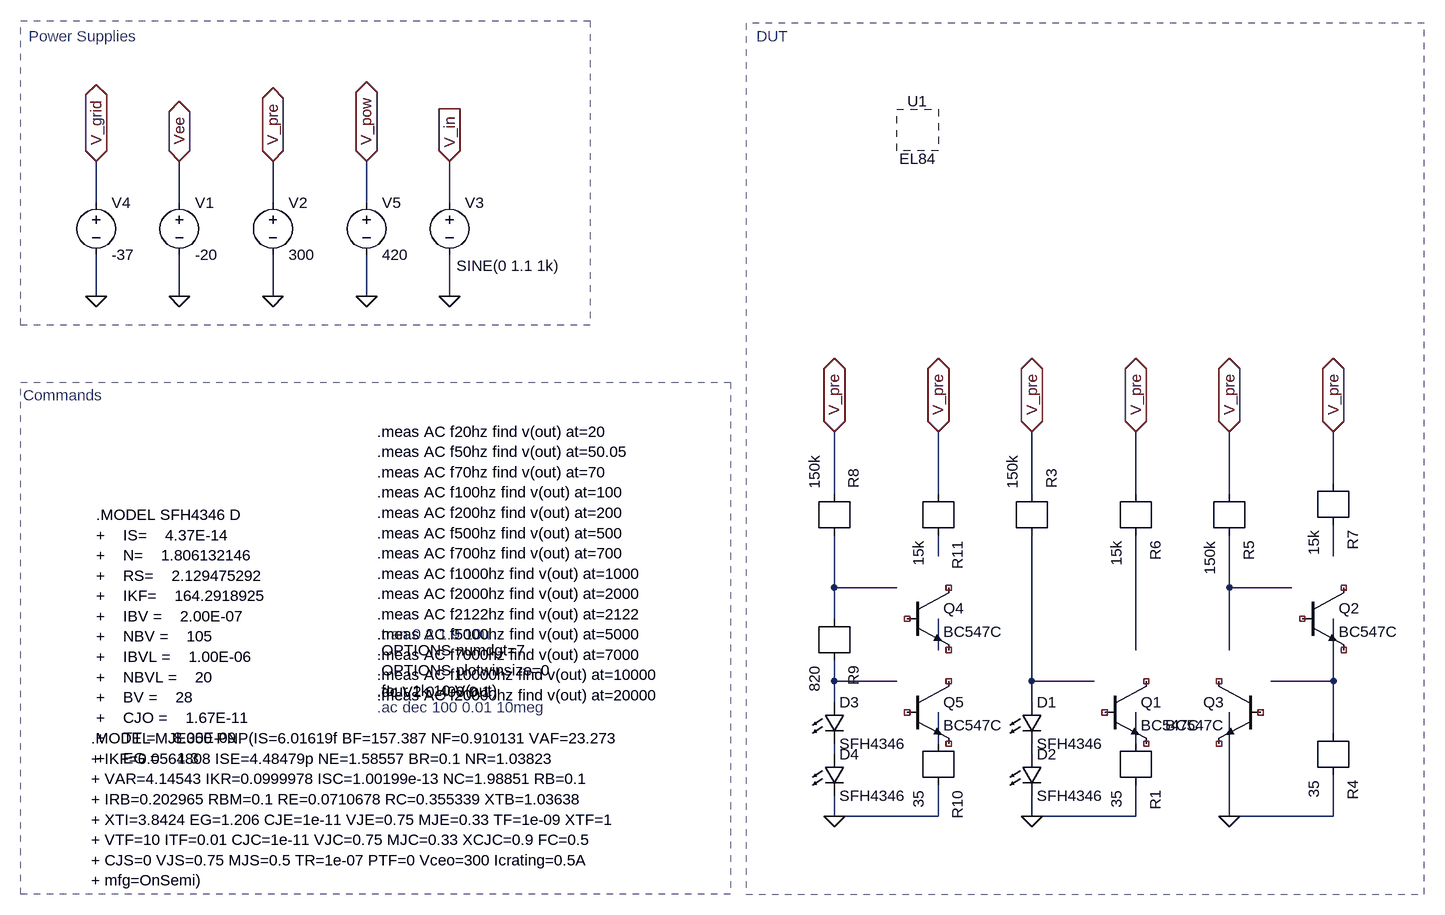
[diagram p0: schematic POWER_AMP_IC_current_sink.asc]
POWER_AMP_IC_current_sink.asc, the LTspice schematic file:
Version 4
SHEET 1 2044 1972
WIRE -2512 688 -2512 624
WIRE -2384 688 -2384 624
WIRE -2240 688 -2240 624
WIRE -2096 688 -2096 624
WIRE -1968 688 -1968 624
WIRE -2512 832 -2512 768
WIRE -2384 832 -2384 768
WIRE -2240 832 -2240 768
WIRE -2096 832 -2096 768
WIRE -1968 832 -1968 768
WIRE -608 1120 -608 1040
WIRE -1376 1136 -1376 1040
WIRE -1216 1136 -1216 1040
WIRE -1072 1136 -1072 1040
WIRE -912 1136 -912 1040
WIRE -768 1136 -768 1040
WIRE -1216 1232 -1216 1200
WIRE -608 1232 -608 1184
WIRE -1376 1280 -1376 1200
WIRE -1280 1280 -1376 1280
WIRE -768 1280 -768 1200
WIRE -672 1280 -768 1280
WIRE -1376 1328 -1376 1280
WIRE -1216 1376 -1216 1328
WIRE -912 1376 -912 1200
WIRE -768 1376 -768 1280
WIRE -1376 1424 -1376 1392
WIRE -1280 1424 -1376 1424
WIRE -1072 1424 -1072 1200
WIRE -976 1424 -1072 1424
WIRE -608 1424 -608 1328
WIRE -608 1424 -704 1424
WIRE -1376 1456 -1376 1424
WIRE -1072 1456 -1072 1424
WIRE -608 1504 -608 1424
WIRE -1216 1520 -1216 1472
WIRE -912 1520 -912 1472
WIRE -1376 1536 -1376 1520
WIRE -1072 1536 -1072 1520
WIRE -1376 1632 -1376 1600
WIRE -1216 1632 -1216 1584
WIRE -1216 1632 -1376 1632
WIRE -1072 1632 -1072 1600
WIRE -912 1632 -912 1584
WIRE -912 1632 -1072 1632
WIRE -768 1632 -768 1472
WIRE -608 1632 -608 1568
WIRE -608 1632 -768 1632
FLAG -1968 832 0
FLAG -2096 832 0
FLAG -2240 832 0
FLAG -2384 832 0
FLAG -2512 832 0
FLAG -2512 624 V_grid
IOPIN -2512 624 BiDir
FLAG -2384 624 Vee
IOPIN -2384 624 BiDir
FLAG -2240 624 V_pre
IOPIN -2240 624 BiDir
FLAG -2096 624 V_pow
IOPIN -2096 624 BiDir
FLAG -1968 624 V_in
IOPIN -1968 624 In
FLAG -1072 1040 V_pre
IOPIN -1072 1040 BiDir
FLAG -912 1040 V_pre
IOPIN -912 1040 BiDir
FLAG -768 1040 V_pre
IOPIN -768 1040 BiDir
FLAG -608 1040 V_pre
IOPIN -608 1040 BiDir
FLAG -1072 1632 0
FLAG -768 1632 0
FLAG -1376 1040 V_pre
IOPIN -1376 1040 BiDir
FLAG -1216 1040 V_pre
IOPIN -1216 1040 BiDir
FLAG -1376 1632 0
SYMBOL npn -960 1424 R0
SYMATTR InstName Q1
SYMATTR Value BC547C
SYMBOL r -912 1520 R90
SYMATTR InstName R1
SYMATTR Value 35
SYMBOL r -1072 1200 M270
SYMATTR InstName R3
SYMATTR Value 150k
SYMBOL voltage -2384 672 R0
SYMATTR InstName V1
SYMATTR Value -20
SYMBOL voltage -2240 672 R0
SYMATTR InstName V2
SYMATTR Value 300
SYMBOL voltage -1968 672 R0
WINDOW 3 11 113 Left 2
SYMATTR Value SINE(0 1.1 1k)
SYMATTR InstName V3
SYMATTR Value2 AC 1
SYMBOL voltage -2512 672 R0
SYMATTR InstName V4
SYMATTR Value -37
SYMBOL voltage -2096 672 R0
SYMATTR InstName V5
SYMATTR Value 420
SYMBOL npn -656 1280 R0
SYMATTR InstName Q2
SYMATTR Value BC547C
SYMBOL npn -720 1424 M0
SYMATTR InstName Q3
SYMATTR Value BC547C
SYMBOL r -608 1504 R90
SYMATTR InstName R4
SYMATTR Value 35
SYMBOL r -768 1136 R90
SYMATTR InstName R5
SYMATTR Value 150k
SYMBOL r -912 1136 R90
SYMATTR InstName R6
SYMATTR Value 15k
SYMBOL r -608 1120 R90
SYMATTR InstName R7
SYMATTR Value 15k
SYMBOL LED -1088 1456 R0
SYMATTR InstName D1
SYMATTR Value SFH4346
SYMBOL LED -1088 1536 R0
SYMATTR InstName D2
SYMATTR Value SFH4346
SYMBOL r -1376 1328 R90
SYMATTR InstName R9
SYMATTR Value 820
SYMBOL r -1216 1520 R90
SYMATTR InstName R10
SYMATTR Value 35
SYMBOL npn -1264 1280 R0
SYMATTR InstName Q4
SYMATTR Value BC547C
SYMBOL npn -1264 1424 R0
SYMATTR InstName Q5
SYMATTR Value BC547C
SYMBOL r -1376 1200 M270
SYMATTR InstName R8
SYMATTR Value 150k
SYMBOL r -1216 1136 R90
SYMATTR InstName R11
SYMATTR Value 15k
SYMBOL LED -1392 1456 R0
SYMATTR InstName D3
SYMATTR Value SFH4346
SYMBOL LED -1392 1536 R0
SYMATTR InstName D4
SYMATTR Value SFH4346
SYMBOL EL84 -1248 576 R0
SYMATTR InstName U1
TEXT -2080 1352 Left 2 ;.tran 0 2 1.9 10u
TEXT -2080 1376 Left 2 !.OPTIONS numdgt=7\n.OPTIONS plotwinsize=0\n.four 1k 10 V(out)
TEXT -2512 1168 Left 2 !.MODEL SFH4346 D	\n+	IS=	4.37E-14\n+	N=	1.806132146\n+	RS=	2.129475292\n+	IKF=	164.2918925\n+	IBV =	2.00E-07\n+	NBV =	105\n+	IBVL =	1.00E-06\n+	NBVL =	20\n+	BV =	28\n+	CJO =	1.67E-11\n+	TT =	8.00E-09\n+	EG =	1.3
TEXT -2520 1512 Left 2 !.MODEL MJE350 PNP(IS=6.01619f BF=157.387 NF=0.910131 VAF=23.273\n+ IKF=0.0564808 ISE=4.48479p NE=1.58557 BR=0.1 NR=1.03823\n+ VAR=4.14543 IKR=0.0999978 ISC=1.00199e-13 NC=1.98851 RB=0.1\n+ IRB=0.202965 RBM=0.1 RE=0.0710678 RC=0.355339 XTB=1.03638\n+ XTI=3.8424 EG=1.206 CJE=1e-11 VJE=0.75 MJE=0.33 TF=1e-09 XTF=1\n+ VTF=10 ITF=0.01 CJC=1e-11 VJC=0.75 MJC=0.33 XCJC=0.9 FC=0.5\n+ CJS=0 VJS=0.75 MJS=0.5 TR=1e-07 PTF=0 Vceo=300 Icrating=0.5A\n+ mfg=OnSemi)
TEXT -2080 1464 Left 2 ;.ac dec 100 0.01 10meg
TEXT -2080 1040 Left 2 !.meas AC f20hz find v(out) at=20\n.meas AC f50hz find v(out) at=50.05\n.meas AC f70hz find v(out) at=70\n.meas AC f100hz find v(out) at=100\n.meas AC f200hz find v(out) at=200\n.meas AC f500hz find v(out) at=500\n.meas AC f700hz find v(out) at=700\n.meas AC f1000hz find v(out) at=1000\n.meas AC f2000hz find v(out) at=2000\n.meas AC f2122hz find v(out) at=2122\n.meas AC f5000hz find v(out) at=5000\n.meas AC f7000hz find v(out) at=7000\n.meas AC f10000hz find v(out) at=10000\n.meas AC f20000hz find v(out) at=20000
TEXT -2624 984 Left 2 ;Commands
TEXT -2616 432 Left 2 ;Power Supplies
TEXT -1496 432 Left 2 ;DUT
TEXT -2080 1440 Left 2 !.dc V2 0 400 0.1
RECTANGLE Normal -2628 964 -1536 1752 2
RECTANGLE Normal -2628 408 -1752 876 2
RECTANGLE Normal -1512 1752 -468 412 2

The netlist it stands for:
* POWER_AMP_IC_current_sink.asc
* Q1: BC547C (symbol npn not certain, pin order unknown); nets seen at it: 0
R1 0 N011 35
R3 V_pre N008 150k
V1 Vee 0 -20
V2 V_pre 0 300
V3 V_in 0 SINE(0 1.1 1k) AC 1
V4 V_grid 0 -37
V5 V_pow 0 420
* Q2: BC547C (symbol npn not certain, pin order unknown); nets seen at it: 0
* Q3: BC547C (symbol npn not certain, pin order unknown); nets seen at it: 0
R4 0 N009 35
R5 N004 V_pre 150k
R6 N006 V_pre 15k
R7 N002 V_pre 15k
D1 N008 N013 SFH4346
D2 N013 0 SFH4346
R9 N007 N003 820
R10 0 N010 35
* Q4: BC547C (symbol npn not certain, pin order unknown); nets seen at it: 0
* Q5: BC547C (symbol npn not certain, pin order unknown); nets seen at it: 0
R8 V_pre N003 150k
R11 N001 V_pre 15k
D3 N007 N012 SFH4346
D4 N012 0 SFH4346
* U1: EL84 (symbol EL84 not available, pin order unknown); nets seen at it: 
.model D D
.lib standard.dio
* .tran 0 2 1.9 10u
.OPTIONS numdgt=7
.OPTIONS plotwinsize=0
.four 1k 10 V(out)
.MODEL SFH4346 D
+	IS=	4.37E-14
+	N=	1.806132146
+	RS=	2.129475292
+	IKF=	164.2918925
+	IBV =	2.00E-07
+	NBV =	105
+	IBVL =	1.00E-06
+	NBVL =	20
+	BV =	28
+	CJO =	1.67E-11
+	TT =	8.00E-09
+	EG =	1.3
.MODEL MJE350 PNP(IS=6.01619f BF=157.387 NF=0.910131 VAF=23.273
+ IKF=0.0564808 ISE=4.48479p NE=1.58557 BR=0.1 NR=1.03823
+ VAR=4.14543 IKR=0.0999978 ISC=1.00199e-13 NC=1.98851 RB=0.1
+ IRB=0.202965 RBM=0.1 RE=0.0710678 RC=0.355339 XTB=1.03638
+ XTI=3.8424 EG=1.206 CJE=1e-11 VJE=0.75 MJE=0.33 TF=1e-09 XTF=1
+ VTF=10 ITF=0.01 CJC=1e-11 VJC=0.75 MJC=0.33 XCJC=0.9 FC=0.5
+ CJS=0 VJS=0.75 MJS=0.5 TR=1e-07 PTF=0 Vceo=300 Icrating=0.5A
+ mfg=OnSemi)
* .ac dec 100 0.01 10meg
.meas AC f20hz find v(out) at=20
.meas AC f50hz find v(out) at=50.05
.meas AC f70hz find v(out) at=70
.meas AC f100hz find v(out) at=100
.meas AC f200hz find v(out) at=200
.meas AC f500hz find v(out) at=500
.meas AC f700hz find v(out) at=700
.meas AC f1000hz find v(out) at=1000
.meas AC f2000hz find v(out) at=2000
.meas AC f2122hz find v(out) at=2122
.meas AC f5000hz find v(out) at=5000
.meas AC f7000hz find v(out) at=7000
.meas AC f10000hz find v(out) at=10000
.meas AC f20000hz find v(out) at=20000
* Commands
* Power Supplies
* DUT
.dc V2 0 400 0.1
.backanno
.end